# EAGLE schematic linesensor2 (EAGLE 6.5.0)
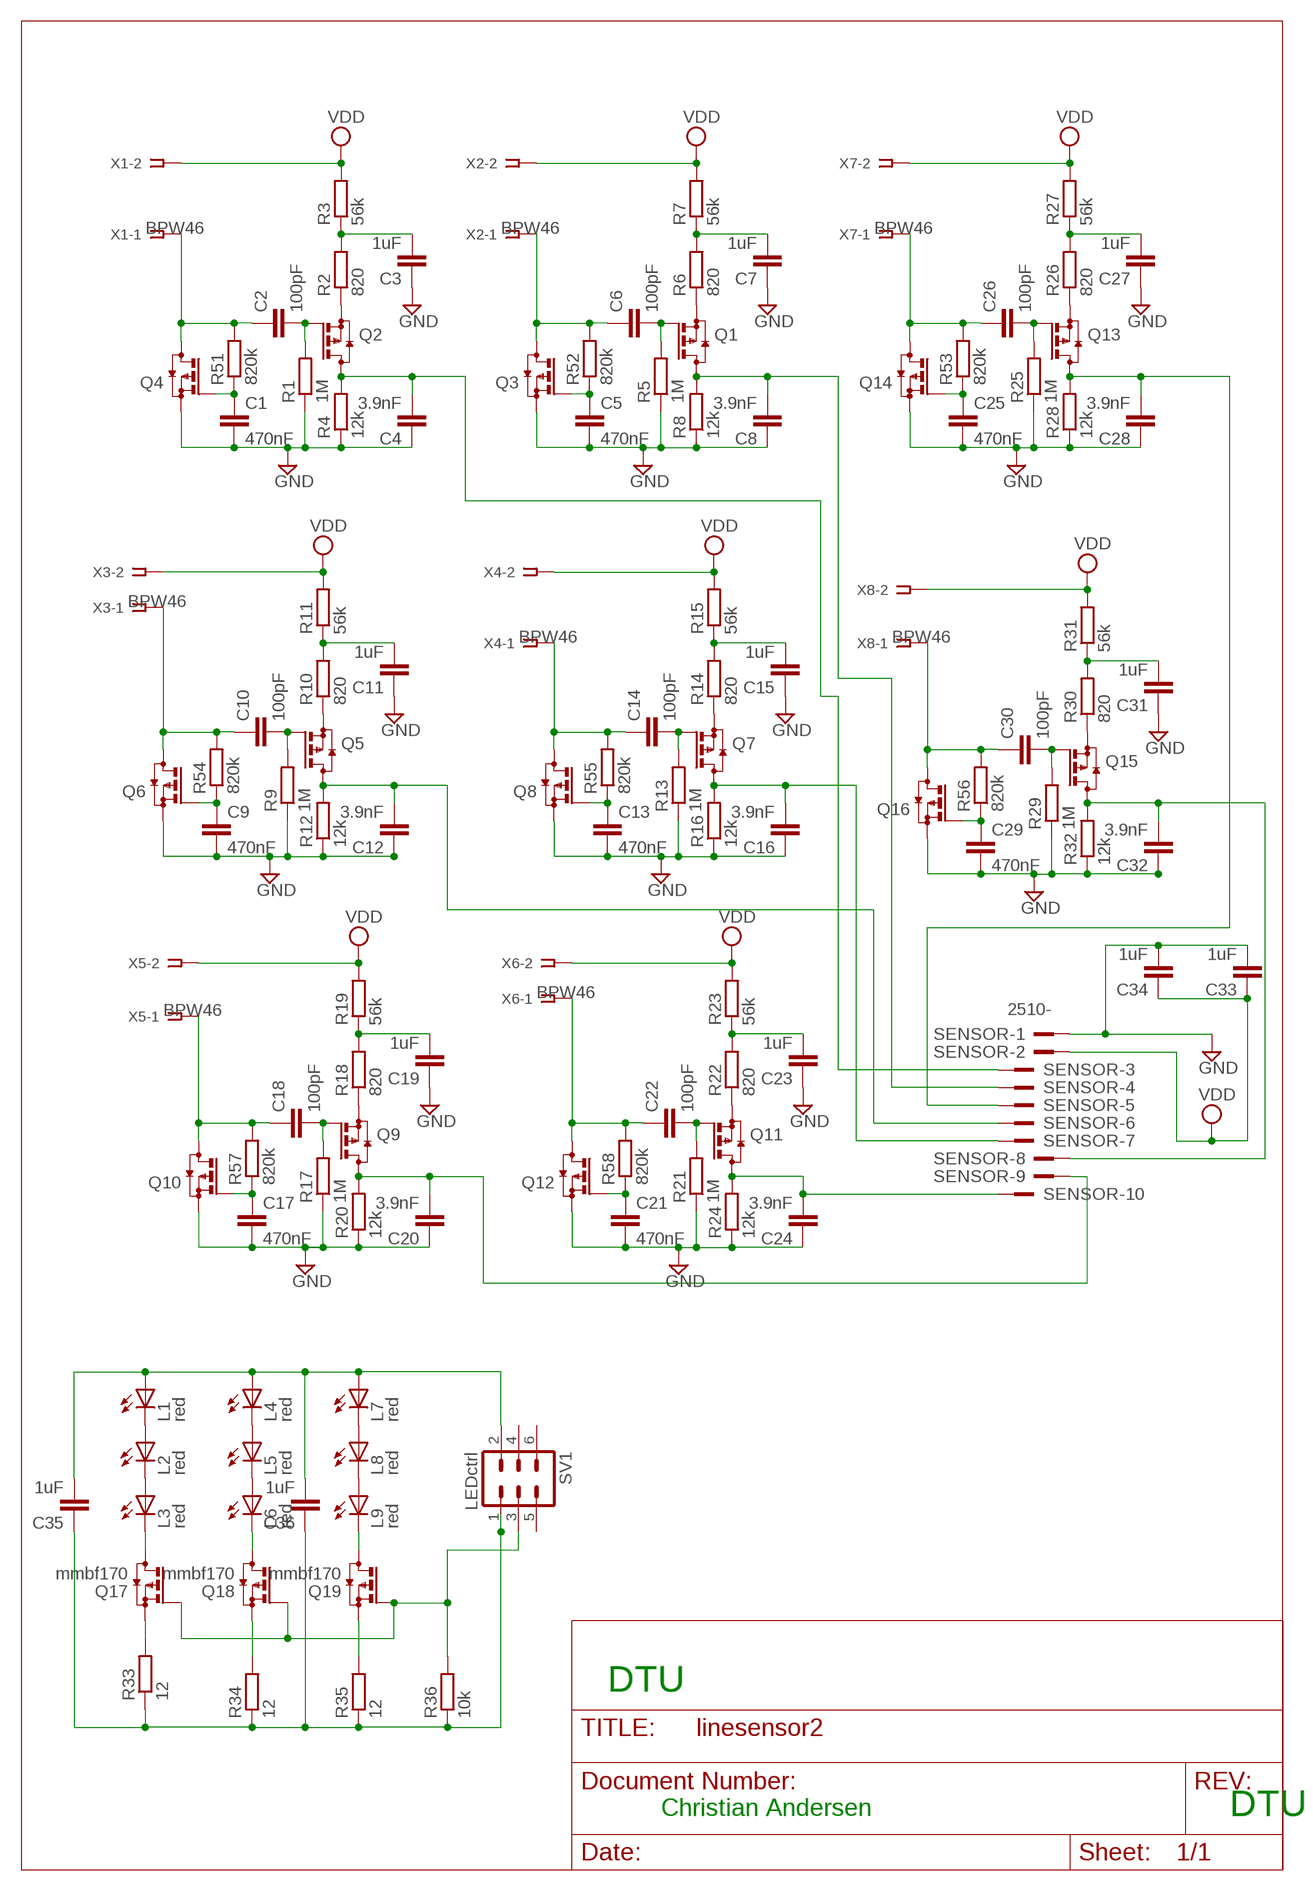
[diagram p0: schematic, sheet 1]

## Parts
C1  470nF  C  [C0805]
C2  100pF  C  [C0805]
C3  1uF  C  [C0805]
C4  3.9nF  C  [C0805]
C5  470nF  C  [C0805]
C6  100pF  C  [C0805]
C7  1uF  C  [C0805]
C8  3.9nF  C  [C0805]
C9  470nF  C  [C0805]
C10  100pF  C  [C0805]
C11  1uF  C  [C0805]
C12  3.9nF  C  [C0805]
C13  470nF  C  [C0805]
C14  100pF  C  [C0805]
C15  1uF  C  [C0805]
C16  3.9nF  C  [C0805]
C17  470nF  C  [C0805]
C18  100pF  C  [C0805]
C19  1uF  C  [C0805]
C20  3.9nF  C  [C0805]
C21  470nF  C  [C0805]
C22  100pF  C  [C0805]
C23  1uF  C  [C0805]
C24  3.9nF  C  [C0805]
C25  470nF  C  [C0805]
C26  100pF  C  [C0805]
C27  1uF  C  [C0805]
C28  3.9nF  C  [C0805]
C29  470nF  C  [C0805]
C30  100pF  C  [C0805]
C31  1uF  C  [C0805]
C32  3.9nF  C  [C0805]
C33  1uF  C  [C0805]
C34  1uF  C  [C0805]
C35  1uF  C  [C0805]
C36  1uF  C  [C0805]
L1  red  LED3MM  [LED3MM]
L2  red  LED3MM  [LED3MM]
L3  red  LED3MM  [LED3MM]
L4  red  LED3MM  [LED3MM]
L5  red  LED3MM  [LED3MM]
L6  red  LED3MM  [LED3MM]
L7  red  LED3MM  [LED3MM]
L8  red  LED3MM  [LED3MM]
L9  red  LED3MM  [LED3MM]
Q1  BSS84  [SOT23]
Q2  BSS84  [SOT23]
Q3  BSS84  [SOT23]
Q4  BSS84  [SOT23]
Q5  BSS84  [SOT23]
Q6  BSS84  [SOT23]
Q7  BSS84  [SOT23]
Q8  BSS84  [SOT23]
Q9  BSS84  [SOT23]
Q10  BSS84  [SOT23]
Q11  BSS84  [SOT23]
Q12  BSS84  [SOT23]
Q13  BSS84  [SOT23]
Q14  BSS84  [SOT23]
Q15  BSS84  [SOT23]
Q16  BSS84  [SOT23]
Q17  mmbf170  BSS84  [SOT23]
Q18  mmbf170  BSS84  [SOT23]
Q19  mmbf170  BSS84  [SOT23]
R1  1M  RR0603  [R0603]
R2  820  RR0603  [R0603]
R3  56k  RR0603  [R0603]
R4  12k  RR0603  [R0603]
R5  1M  RR0603  [R0603]
R6  820  RR0603  [R0603]
R7  56k  RR0603  [R0603]
R8  12k  RR0603  [R0603]
R9  1M  RR0603  [R0603]
R10  820  RR0603  [R0603]
R11  56k  RR0603  [R0603]
R12  12k  RR0603  [R0603]
R13  1M  RR0603  [R0603]
R14  820  RR0603  [R0603]
R15  56k  RR0603  [R0603]
R16  12k  RR0603  [R0603]
R17  1M  RR0603  [R0603]
R18  820  RR0603  [R0603]
R19  56k  RR0603  [R0603]
R20  12k  RR0603  [R0603]
R21  1M  RR0603  [R0603]
R22  820  RR0603  [R0603]
R23  56k  RR0603  [R0603]
R24  12k  RR0603  [R0603]
R25  1M  RR0603  [R0603]
R26  820  RR0603  [R0603]
R27  56k  RR0603  [R0603]
R28  12k  RR0603  [R0603]
R29  1M  RR0603  [R0603]
R30  820  RR0603  [R0603]
R31  56k  RR0603  [R0603]
R32  12k  RR0603  [R0603]
R33  12  RR0603  [R0603]
R34  12  RR0603  [R0603]
R35  12  RR0603  [R0603]
R36  10k  RR0603  [R0603]
R51  820k  RR0603  [R0603]
R52  820k  RR0603  [R0603]
R53  820k  RR0603  [R0603]
R54  820k  RR0603  [R0603]
R55  820k  RR0603  [R0603]
R56  820k  RR0603  [R0603]
R57  820k  RR0603  [R0603]
R58  820k  RR0603  [R0603]
SENSOR  2510-  [PAK100/2500-10]
SV1  LEDctrl  MA03-2  [MA03-2]
X1  SSW-102-02-S-S-RA  [SSW-102-02-S-S-RA]
X2  SSW-102-02-S-S-RA  [SSW-102-02-S-S-RA]
X3  SSW-102-02-S-S-RA  [SSW-102-02-S-S-RA]
X4  SSW-102-02-S-S-RA  [SSW-102-02-S-S-RA]
X5  SSW-102-02-S-S-RA  [SSW-102-02-S-S-RA]
X6  SSW-102-02-S-S-RA  [SSW-102-02-S-S-RA]
X7  SSW-102-02-S-S-RA  [SSW-102-02-S-S-RA]
X8  SSW-102-02-S-S-RA  [SSW-102-02-S-S-RA]

## Nets
GATE_CTRL: Q17.1(G) Q18.1(G) Q19.1(G) R36.2 SV1.3
GND: C1.2 C3.1 C4.1 C5.2 C7.1 C8.1 C9.2 C11.1 C12.1 C13.2 C15.1 C16.1 C17.2 C19.1 C20.1 C21.2 C23.1 C24.1 C25.2 C27.1 C28.1 C29.2 C31.1 C32.1 C33.2 C34.2 Q3.2(S) Q4.2(S) Q6.2(S) Q8.2(S) Q10.2(S) Q12.2(S) Q14.2(S) Q16.2(S) R1.1 R4.1 R5.1 R8.1 R9.1 R12.1 R13.1 R16.1 R17.1 R20.1 R21.1 R24.1 R25.1 R28.1 R29.1 R32.1 SENSOR.1
GND2: C35.1 C36.1 R33.1 R34.1 R35.1 R36.1 SV1.1
LS0: C4.2 Q2.3(D) R4.2 SENSOR.3
LS1: C8.2 Q1.3(D) R8.2 SENSOR.4
LS2: C28.2 Q13.3(D) R28.2 SENSOR.5
LS3: C12.2 Q5.3(D) R12.2 SENSOR.6
LS5: C32.2 Q15.3(D) R32.2 SENSOR.8
LS6: C20.2 Q9.3(D) R20.2 SENSOR.9
LS7: C24.2 Q11.3(D) R24.2 SENSOR.10
N$1: Q2.2(S) R2.1
N$2: Q1.2(S) R6.1
N$3: C1.1 Q4.1(G) R51.1
N$4: C2.1 Q4.3(D) R51.2 X1.1
N$5: C2.2 Q2.1(G) R1.2
N$6: L1.K(C) L2.A
N$7: C3.2 R2.2 R3.1
N$8: C5.1 Q3.1(G) R52.1
N$9: C6.1 Q3.3(D) R52.2 X2.1
N$10: C6.2 Q1.1(G) R5.2
N$11: L2.K(C) L3.A
N$12: C7.2 R6.2 R7.1
N$14: Q5.2(S) R10.1
N$15: C9.1 Q6.1(G) R54.1
N$16: C10.1 Q6.3(D) R54.2 X3.1
N$17: C10.2 Q5.1(G) R9.2
N$18: L4.K(C) L5.A
N$19: C11.2 R10.2 R11.1
N$20: Q7.2(S) R14.1
N$21: C13.1 Q8.1(G) R55.1
N$22: C14.1 Q8.3(D) R55.2 X4.1
N$23: C14.2 Q7.1(G) R13.2
N$24: L5.K(C) L6.A
N$25: C15.2 R14.2 R15.1
N$26: Q9.2(S) R18.1
N$27: C17.1 Q10.1(G) R57.1
N$28: C18.1 Q10.3(D) R57.2 X5.1
N$29: C18.2 Q9.1(G) R17.2
N$30: L7.K(C) L8.A
N$31: C19.2 R18.2 R19.1
N$32: Q11.2(S) R22.1
N$33: C21.1 Q12.1(G) R58.1
N$34: C22.1 Q12.3(D) R58.2 X6.1
N$35: C22.2 Q11.1(G) R21.2
N$36: L8.K(C) L9.A
N$37: C23.2 R22.2 R23.1
N$38: Q13.2(S) R26.1
N$39: C25.1 Q14.1(G) R53.1
N$40: C26.1 Q14.3(D) R53.2 X7.1
N$41: C26.2 Q13.1(G) R25.2
N$42: L3.K(C) Q17.3(D)
N$43: C27.2 R26.2 R27.1
N$44: Q15.2(S) R30.1
N$45: C29.1 Q16.1(G) R56.1
N$46: C30.1 Q16.3(D) R56.2 X8.1
N$47: C30.2 Q15.1(G) R29.2
N$48: L6.K(C) Q18.3(D)
N$49: C31.2 R30.2 R31.1
N$50: L9.K(C) Q19.3(D)
N$51: Q17.2(S) R33.2
N$52: Q18.2(S) R34.2
N$53: Q19.2(S) R35.2
N$56: C16.2 Q7.3(D) R16.2 SENSOR.7
VDD: C33.1 C34.1 R3.2 R7.2 R11.2 R15.2 R19.2 R23.2 R27.2 R31.2 SENSOR.2 X1.2 X2.2 X3.2 X4.2 X5.2 X6.2 X7.2 X8.2
VDD2: C35.2 C36.2 L1.A L4.A L7.A SV1.2
Unconnected: SV1.4 SV1.5 SV1.6

## Notes on the sheet
- DTU
- Christian Andersen | DTU

## Library data of the parts
C1-C36 = eagle-ltspice:C: CAPACITOR, European symbol; SPICEMODEL: NONE; SPICEPREFIX: C
L1-L9 = led:LED: LED OSRAM: - CHIPLED LG R971, LG N971, LY N971, LG Q971, LY Q971, LO R971, LY R971 LH N974, LH R974 LS Q976, LO Q976, LY Q976 LO Q996 - Hyper CHIPLED LW Q18S LB Q993, LB Q99A, LB R99A - SideLED LS A670, LO A670, LY A670, LG A670, LP A670 LB A673, LV A673, LT A673, LW A673 LH A674 LY A675 LS A676, LA A676, LO A676, LY A676, LW A676 LS A679, LY A679, LG A679 - Hyper Micro SIDELED® LS Y876, LA Y876, LO Y876, LY Y876 LT Y87S - SmartLED LW L88C, LW L88S LB L89C, LB L89S, LG L890 LS L89K, LO L89K, LY L89K LS L896, LA L896, LO L896, LY L896 - TOPLED LS T670, LO T670, LY T670, LG T670, LP T670 LSG T670, LSP T670, LSY T670, LOP T670, LYG T670 LG T671, LOG T671, LSG T671 LB T673, LV T673, LT T673, LW T673 LH T674 LS T676, LA T676, LO T676, LY T676, LB T676, LH T676, LSB T676, LW T676 LB T67C, LV T67C, LT T67C, LS T67K, LO T67K, LY T67K, LW E67C LS E67B, LA E67B, LO E67B, LY E67B, LB E67C, LV E67C, LT E67C LW T67C LS T679, LY T679, LG T679 LS T770, LO T770, LY T770, LG T770, LP T770 LB T773, LV T773, LT T773, LW T773 LH T774 LS E675, LA E675, LY E675, LS T675 LS T776, LA T776, LO T776, LY T776, LB T776 LHGB T686 LT T68C, LB T68C - Hyper Mini TOPLED® LB M676 - Mini TOPLED Santana® LG M470 LS M47K, LO M47K, LY M47K Source: http://www.osram.convergy.de LUXEON: - LUMILED® LXK2-PW12-R00, LXK2-PW12-S00, LXK2-PW14-U00, LXK2-PW14-V00 LXK2-PM12-R00, LXK2-PM12-S00, LXK2-PM14-U00 LXK2-PE12-Q00, LXK2-PE12-R00, LXK2-PE12-S00, LXK2-PE14-T00, LXK2-PE14-U00 LXK2-PB12-K00, LXK2-PB12-L00, LXK2-PB12-M00, LXK2-PB14-N00, LXK2-PB14-P00, LXK2-PB14-Q00 LXK2-PR12-L00, LXK2-PR12-M00, LXK2-PR14-Q00, LXK2-PR14-R00 LXK2-PD12-Q00, LXK2-PD12-R00, LXK2-PD12-S00 LXK2-PH12-R00, LXK2-PH12-S00 LXK2-PL12-P00, LXK2-PL12-Q00, LXK2-PL12-R00 Source: www.luxeon.com KINGBRIGHT: KA-3528ASYC Source: www.kingbright.com
Q1-Q19 = transistor-small-signal:BSS84: P-CHANNEL MOS FET
R1-R36 R51-R58 = eagle-ltspice:R: RESISTOR, European symbol; SPICEMODEL: NONE; SPICEPREFIX: R
SENSOR = con-3m:2510-: 3M (TM) Pak 100 4-Wall Header Source: 3M; MF: 3M; MPN: 2510-6002UB; OC_FARNELL: 9838244; OC_NEWARK: 46F4725
SV1 = con-lstb:MA03-2: PIN HEADER; OC_FARNELL: unknown; OC_NEWARK: unknown
X1-X8 = con-samtec:SSW-102-02-S-S: THROUGH-HOLE .025" SQ POST SOCKET Source: Samtec SSW.pdf; MPN: BPW46; OC_FARNELL: unknown; OC_NEWARK: 11P9352